# Altium project GWNv3.PrjPCB
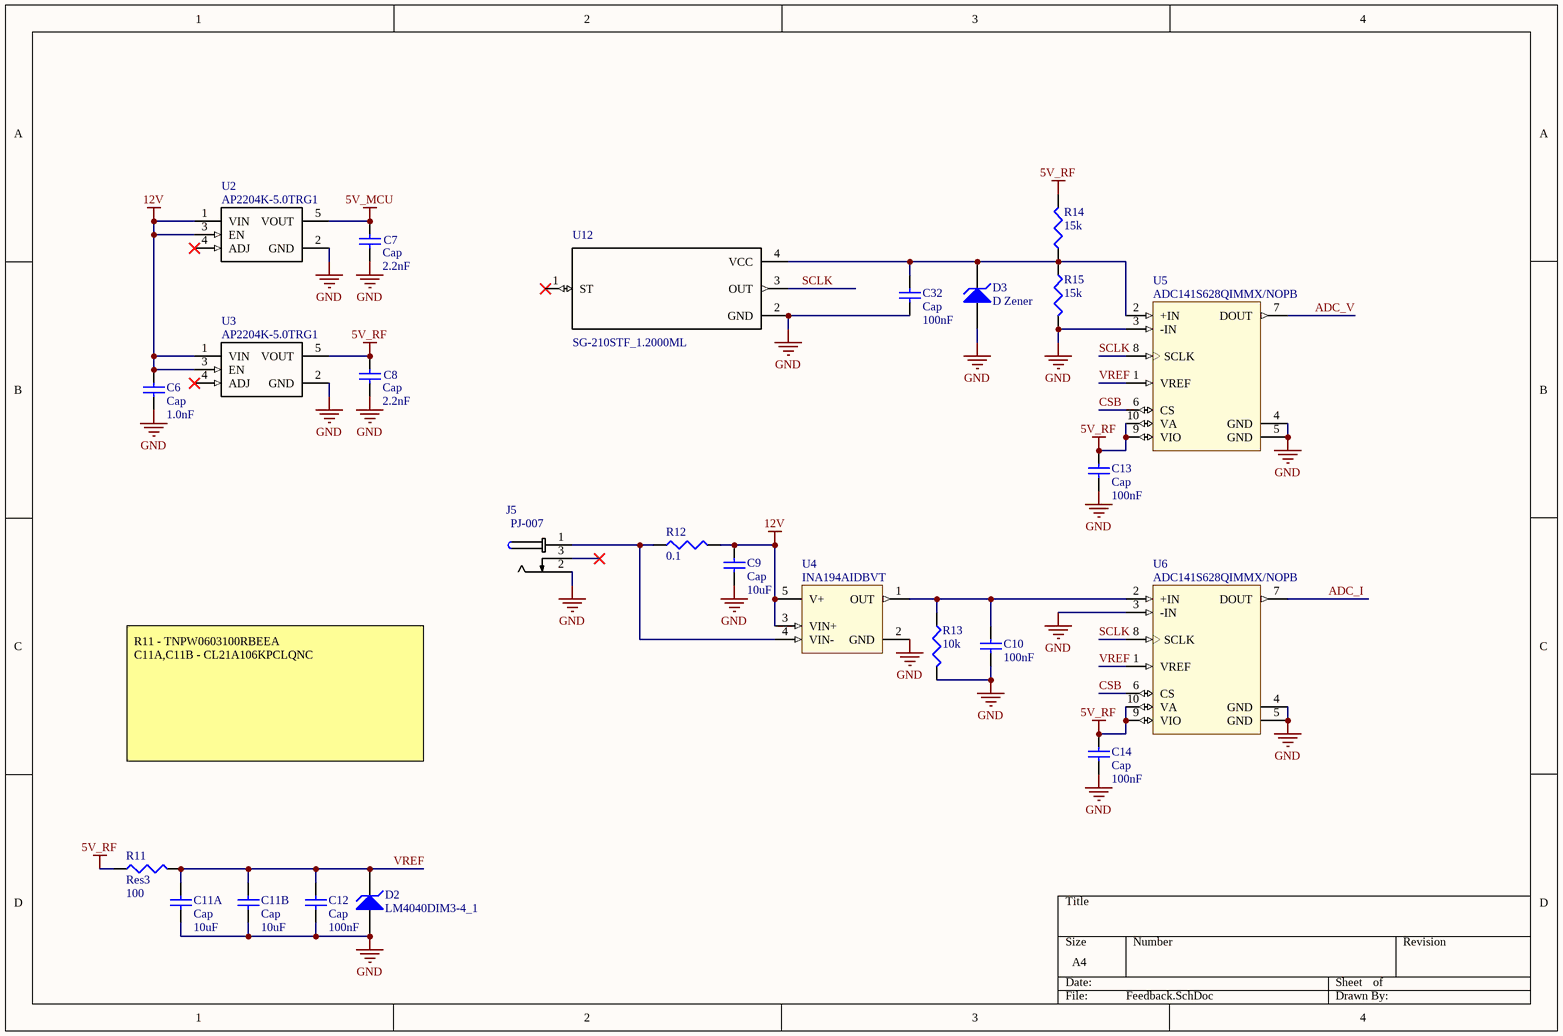
[diagram p0: Feedback.SchDoc]
3 sheets, 65 parts. Net scope: global (net labels, ports and power ports of the same name join across sheets).
Board files: GWNv3.PcbDoc, GWNv3_Station.PcbDoc
Sheets:
  Feedback.SchDoc
  RF.SchDoc
  BridgeRF.SchDoc

## Sheet Feedback.SchDoc
size A4

### Parts
C6  Cap  value 1.0nF  [1608[0603]]
C7  Cap  value 2.2nF  [1608[0603]]
C8  Cap  value 2.2nF  [1608[0603]]
C9  Cap  value 10uF  [C0805]
C10  100nF  [1608[0603]]
C11A  Cap  value 10uF  [C0805]
C11B  Cap  value 10uF  [C0805]
C12  Cap  value 100nF  [1608[0603]]
C13  Cap  value 100nF  [1608[0603]]
C14  Cap  value 100nF  [1608[0603]]
C32  Cap  value 100nF  [1608[0603]]
D2  LM4040DIM3-4_1  [SOT95P237X112-3N]
D3  D Zener  [SODFL250X110-2N]
J5  PJ-007  [PJ-007]
R11  Res3  value 100  [J1-0603]
R12  0.1  [TO-252-3]
R13  10k  [J1-0603]
R14  15k  [J1-0603]
R15  15k  [J1-0603]
U2  AP2204K-5.0TRG1  [SOT95P280X145-5N]
U3  AP2204K-5.0TRG1  [SOT95P280X145-5N]
U4  INA194AIDBVT  [SOT95P280X145-5N]
U5  ADC141S628QIMMX/NOPB  [SOP50P490X110-11N]
U6  ADC141S628QIMMX/NOPB  [SOP50P490X110-11N]
U12  SG-210STF_1.2000ML  [OSCCC200X160X50]

### Nets
5V_MCU: C7.2 U2.5(VOUT)
5V_RF: C8.2 C13.1 C14.1 R11.2 R14.1 U3.5(VOUT) U5.9(VIO) U5.10(VA) U6.9(VIO) U6.10(VA)
12V: C6.1 C9.1 R12.1 U2.1(VIN) U2.3(EN) U3.1(VIN) U3.3(EN) U4.3(VIN+) U4.5(V+)
GND: C6.2 C7.1 C8.1 C9.2 C10.1 C11A.2 C11B.2 C12.2 C13.2 C14.2 C32.2 D2.1(A) D3.1(A) J5.2(S) R13.2 R15.1 U2.2(GND) U3.2(GND) U4.2(GND) U5.3(-IN) U5.4(GND) U5.5(GND) U6.3(-IN) U6.4(GND) U6.5(GND) U12.2(GND)
ADC_I: U6.7(DOUT)
ADC_V: U5.7(DOUT)
CSB: U5.6(CS) U6.6(CS)
SCLK: U5.8(SCLK) U6.8(SCLK) U12.3(OUT)
VREF: C11A.1 C11B.1 C12.1 D2.2(K) R11.1 U5.1(VREF) U6.1(VREF)
NetC10_2: C10.2 R13.1 U4.1(OUT) U6.2(+IN)
NetC32_1: C32.1 D3.2(K) R14.2 R15.2 U5.2(+IN) U12.4(VCC)
NetJ5_1: J5.1(T) R12.2 U4.4(VIN-)

Not connected (* = marked no-connect by the designer): J5 3(SS)*; U2 4(ADJ)*; U3 4(ADJ)*; U12 1(ST)*

### Notes on the sheet
- R11 - TNPW0603100RBEEA
  C11A,C11B - CL21A106KPCLQNC

### Library data of the parts
C6-C10 C11A C11B C12-C14 C32 = Cap Semi: Capacitor (Semiconductor SIM Model); Published: 8-Jun-2000; LatestRevisionDate: 29-May-2009; LatestRevisionNote: IPC-7351 Footprint Added.; PackageReference: C1206; Publisher: Altium Limited; PackageDescription: Chip Capacitor
  C10: Value: 100nF
D2 = LM4040DIM3-4_1: IC VREF SHUNT 4.096V SOT23; MF: Texas Instruments; MP: LM404DIM4-4.1; Availability: Good; Package: SOT23 Texas Instruments; Price: 0.41 USD; Value: *; Supplier 1: Digi-Key; Supplier Part Number 1: LM4040DIM3-4.1/NOPBCT-ND
D3 = D Zener: Zener Diode; Published: 8-Jun-2000; LatestRevisionDate: 17-Jul-2002; LatestRevisionNote: Re-released for DXP Platform.; PackageReference: DIODE-0.7; Publisher: Altium Limited; PackageDescription: Diode, Thru-Hole; 2 Leads; 0.7 in Pin Spacing
J5 = PJ-007: 1.3 mm Center Pin, 1.0 A, Right Angle, Through Hole, Dc Power Jack Connector; MF: CUI; SnapEDA_Link: https://www.snapeda.com/parts/PJ-007/CUI/view-part/?ref=snap; Availability: Good; Package: None; Price: 0.36 USD; MP: PJ-007; Value: *
R11-R15 = Res3: Resistor; Published: 8-Jun-2000; LatestRevisionDate: 29-May-2009; LatestRevisionNote: IPC-7351 Footprint Added.; PackageReference: J1-0603; Publisher: Altium Limited; PackageDescription: Chip Resistor
  R12: Value: 0.1
  R13: Value: 10k
  R14 R15: Value: 15k
U2 U3 = AP2204K-5.0TRG1: IC REG LINEAR 5V 150MA SOT23-5; MF: Diodes Inc.; Availability: Good; MP: AP2204K-5.0TRG1; Price: 0.20 USD; Package: SOT-23-5 Diodes Inc.; Value: *
U4 = INA194AIDBVT: IC CURRENT MONITOR 3% SOT23-5; MF: Texas Instruments; Package: SOT-23 Texas Instruments; MP: INA194AIDBVT; Price: 1.55 USD; Availability: Good; Value: *
U5 U6 = ADC141S628QIMMX/NOPB: IC CONVERTER A/D 14-BIT 10-MSOP; MF: Texas Instruments; Availability: Good; Price: 4.07 USD; MP: ADC141S628QIMMX/NOPB; Package: MSOP-10 Texas Instruments; Value: *
U12 = SG-210STF_1.2000ML: Spxo 1.6-3.6v 50ppm -40/+85c; MP: SG-210STF 1.2000ML; MF: EPSON; Availability: Bad; SnapEDA_Link: https://www.snapeda.com/symbols-footprints/SG-210STF%201.2000ML/EPSON/view-part/?ref=snap; Package: SMD-4 Epson; Price: 1.41 USD; Value: *

## Sheet RF.SchDoc
size A4
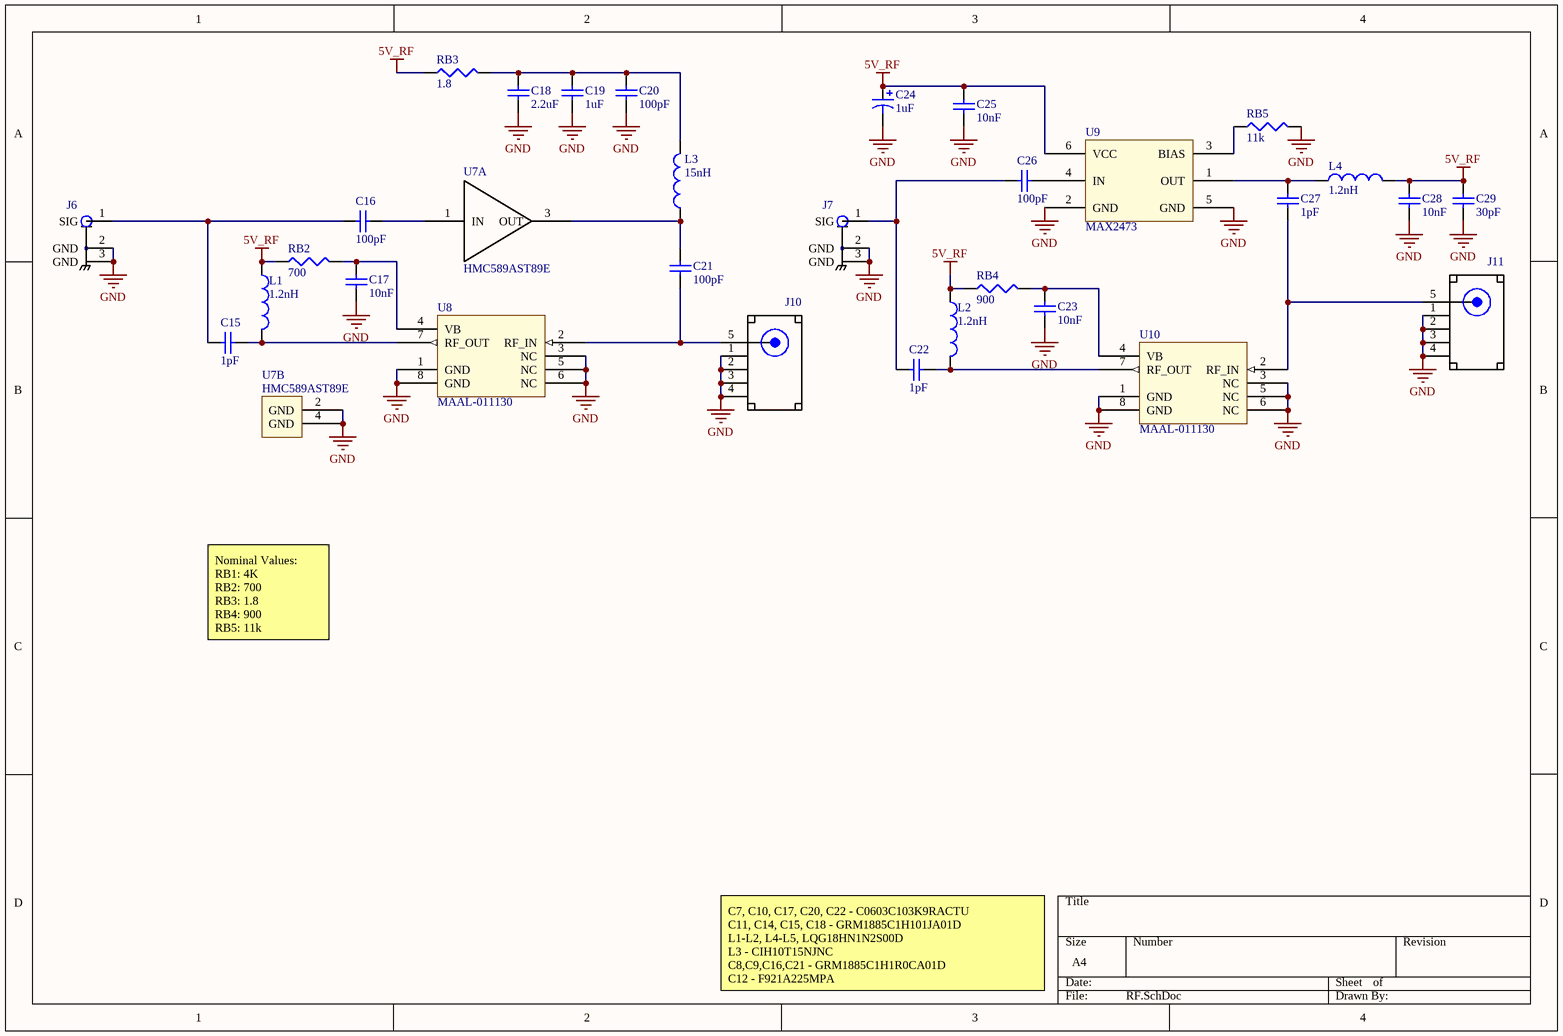
[diagram p1: RF.SchDoc]

### Parts
C15  1pF  [CAPC1608X90X35LL10T15]
C16  100pF  [CAPC0603(1608)100_N]
C17  10nF  [CAPC0603(1608)100_L]
C18  2.2uF  [C1206]
C19  1uF  [CAPC0603(1608)100_N]
C20  100pF  [CAPC0603(1608)100_N]
C21  100pF  [CAPC0603(1608)100_N]
C22  1pF  [CAPC1608X90X35LL10T15]
C23  10nF  [CAPC0603(1608)100_L]
C24  1uF  [CAPAE430X550N]
C25  10nF  [CAPC0603(1608)100_L]
C26  100pF  [CAPC0603(1608)100_N]
C27  1pF  [CAPC1608X90X35LL10T15]
C28  10nF  [CAPC0603(1608)100_L]
C29  30pF  [CAPC1608X90X35LL15T15]
J6  1909763-1  [TE_1909763-1]  (value not drawn)
J7  1909763-1  [TE_1909763-1]  (value not drawn)
J10  5-1814400-1  [CONN_5-1814400-1]  (value not drawn)
J11  5-1814400-1  [CONN_5-1814400-1]  (value not drawn)
L1  1.2nH  [INDC1608L]
L2  1.2nH  [INDC1608L]
L3  15nH  [INDC1608L]
L4  1.2nH  [INDC1608L]
RB2  700  [J1-0603]
RB3  1.8  [J1-0603]
RB4  900  [C1206]
RB5  11k  [J1-0603]
U7  HMC589AST89E  [SOT150P410X160-3N]  (parts A,B of 2)
U8  MAAL-011130  [PQFN50P200X200X100_HS-9N]
U9  MAX2473  [SOT95P280X145-6N]
U10  MAAL-011130  [PQFN50P200X200X100_HS-9N]

### Nets
5V_RF: C24.1 C25.2 C28.2 C29.2 L1.2 L2.2 L4.1 RB2.2 RB3.2 RB4.2 U9.6(VCC)
GND: C17.1 C18.1 C19.2 C20.2 C23.1 C24.2 C25.1 C28.1 C29.1 J6.2(GND) J6.3(GND) J7.2(GND) J7.3(GND) J10.1(GND) J10.2(GND) J10.3(GND) J10.4(GND) J11.1(GND) J11.2(GND) J11.3(GND) J11.4(GND) RB5.1 U7.2(GND) U7.4(GND) U8.1(GND) U8.3(NC) U8.5(NC) U8.6(NC) U8.8(GND) U9.2(GND) U9.5(GND) U10.1(GND) U10.3(NC) U10.5(NC) U10.6(NC) U10.8(GND)
NetC15_1: C15.1 C16.1 J6.1(SIG)
NetC15_2: C15.2 L1.1 U8.7(RF_OUT)
NetC16_2: C16.2 U7.1(IN)
NetC17_2: C17.2 RB2.1 U8.4(VB)
NetC18_2: C18.2 C19.1 C20.1 L3.1 RB3.1
NetC21_1: C21.1 L3.2 U7.3(OUT)
NetC21_2: C21.2 J10.5(SIGNAL) U8.2(RF_IN)
NetC22_1: C22.1 C26.1 J7.1(SIG)
NetC22_2: C22.2 L2.1 U10.7(RF_OUT)
NetC23_2: C23.2 RB4.1 U10.4(VB)
NetC26_2: C26.2 U9.4(IN)
NetC27_1: C27.1 J11.5(SIGNAL) U10.2(RF_IN)
NetC27_2: C27.2 L4.2 U9.1(OUT)
NetRB5_2: RB5.2 U9.3(BIAS)

### Notes on the sheet
- Nominal Values:
  RB1: 4K
  RB2: 700
  RB3: 1.8
  RB4: 900
  RB5: 11k
- C7, C10, C17, C20, C22 - C0603C103K9RACTU
  C11, C14, C15, C18 - GRM1885C1H101JA01D
  L1-L2, L4-L5, LQG18HN1N2S00D
  L3 - CIH10T15NJNC
  C8,C9,C16,C21 - GRM1885C1H1R0CA01D
  C12 - F921A225MPA

### Library data of the parts
C15 C22 C27 = CMP-2006-02464-1: Manufacturer: Murata; Part Number: GRM1885C1H1R0CA01D; Value: 1pF
  C27: Value2: *
C16 C19-C21 C26 = CMP-1035-01269-1: CAP 100pF 50V ±5% 0603 (1608 Metric) Thickness 1mm SMD; Case-EIA: 0603; Case-Metric: 1608; Tolerance: Â±5%; Max Thickness: 1 mm; Rated Voltage: 50 V; Technology: SMT
  C16 C20 C21 C26: Value: 100pF
  C19: Value: 1uF
C17 C23 C25 C28 = CMP-1035-02302-1: CAP 10nF 6.3V ±10% 0603 (1608 Metric) Thickness 1mm SMD; Case-EIA: 0603; Case-Metric: 1608; Tolerance: Â±10%; Value: 10nF; Max Thickness: 1 mm; Rated Voltage: 6.3 V; Technology: SMT
C18 = Cap Semi: Capacitor (Semiconductor SIM Model); Manufacturer: AVX; Part Number: F921A225MPA; Value: 2.2uF
C24 = Cap Pol3: Polarized Capacitor (Surface Mount); Manufacturer: Panasonic; Part Number: EEE-FC1H1R0R; Value: 1uF
C29 = CMP-2006-04292-1: Manufacturer: AVX Interconnect / Elco; Part Number: 06035A300JAT2A; Value: 30pF
J6 J7 = 1909763-1: CONN UMCC JACK STR 50OHM SMD; Number_of_Positions: 1; MF: TE Connectivity; Availability: Good; MP: 1909763-1; Price: 0.28 USD; Package: None; Value: *
J10 J11 = 5-1814400-1: SMA R/A PCB Skt GZD; Number_of_Positions: 1; MF: TE Connectivity; Digi-Key_Purchase_URL: https://www.digikey.com/product-detail/en/te-connectivity-amp-connectors/5-1814400-1/A97593-ND/1755981?WT.z_cid=ref_snapeda&utm_source=snapeda&utm_medium=aggregator&utm_campaign=buynow; Digi-Key_Part_Number: A97593-ND; EU_RoHS_Compliance: Compliant; Package: None; MP: 5-1814400-1; Link: http://www.te.com/usa-en/product-5-1814400-1.html; SnapEDA_Link: https://www.snapeda.com/symbols-footprints/5-1814400-1/TE%20Connectivity%20AMP%20Connectors/view-part/?ref=snap; Value: *
L1 L2 L4 = Inductor: Part Number: LQG15WH1N2S02D; Manufacturer: Murata; Value: 1.2nH
L3 = Inductor: Part Number: CIH10T15NJNC; Manufacturer: Samsung; Value: 15nH
RB2-RB5 = Res3: Resistor; Published: 8-Jun-2000; LatestRevisionDate: 29-May-2009; LatestRevisionNote: IPC-7351 Footprint Added.; PackageReference: J1-0603; Publisher: Altium Limited; PackageDescription: Chip Resistor
  RB2: Value: 700
  RB3: Value: 1.8
  RB4: Value: 900
  RB5: Value: 11k

## Sheet BridgeRF.SchDoc
size A4
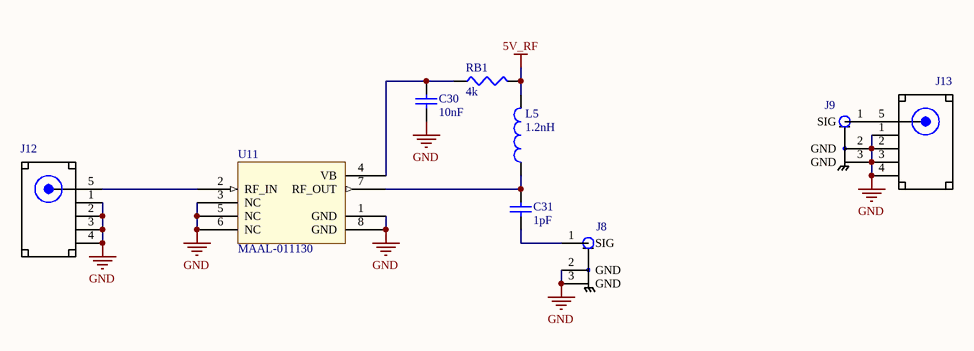
[diagram p2: BridgeRF.SchDoc]

### Parts
C30  10nF  [CAPC0603(1608)100_L]
C31  1pF  [CAPC1608X90X35LL10T15]
J8  1909763-1  [TE_1909763-1]  (value not drawn)
J9  1909763-1  [TE_1909763-1]  (value not drawn)
J12  5-1814400-1  [CONN_5-1814400-1]  (value not drawn)
J13  5-1814400-1  [CONN_5-1814400-1]  (value not drawn)
L5  1.2nH  [INDC1608L]
RB1  4k  [J1-0603]
U11  MAAL-011130  [PQFN50P200X200X100_HS-9N]

### Nets
5V_RF: L5.2 RB1.1
GND: C30.1 J8.2(GND) J8.3(GND) J9.2(GND) J9.3(GND) J12.1(GND) J12.2(GND) J12.3(GND) J12.4(GND) J13.1(GND) J13.2(GND) J13.3(GND) J13.4(GND) U11.1(GND) U11.3(NC) U11.5(NC) U11.6(NC) U11.8(GND)
NetC30_2: C30.2 RB1.2 U11.4(VB)
NetC31_1: C31.1 J8.1(SIG)
NetC31_2: C31.2 L5.1 U11.7(RF_OUT)
NetJ9_1: J9.1(SIG) J13.5(SIGNAL)
NetJ12_5: J12.5(SIGNAL) U11.2(RF_IN)

### Library data of the parts
C30 = CMP-1035-02302-1: as C17 on sheet RF; Value: 10nF; Max Thickness: 1 mm; Rated Voltage: 6.3 V; Technology: SMT
C31 = CMP-2006-02464-1: as C15 on sheet RF; Value: 1pF
J8 J9 = 1909763-1: as J6 on sheet RF; Availability: Good; MP: 1909763-1; Price: 0.28 USD; Package: None; Value: *
J12 J13 = 5-1814400-1: as J10 on sheet RF; Digi-Key_Purchase_URL: https://www.digikey.com/product-detail/en/te-connectivity-amp-connectors/5-1814400-1/A97593-ND/1755981?WT.z_cid=ref_snapeda&utm_source=snapeda&utm_medium=aggregator&utm_campaign=buynow; Digi-Key_Part_Number: A97593-ND; EU_RoHS_Compliance: Compliant; Package: None; MP: 5-1814400-1; Link: http://www.te.com/usa-en/product-5-1814400-1.html; SnapEDA_Link: https://www.snapeda.com/symbols-footprints/5-1814400-1/TE%20Connectivity%20AMP%20Connectors/view-part/?ref=snap; Value: *
L5 = Inductor: as L1 on sheet RF; Value: 1.2nH
RB1 = Res3: Resistor; Published: 8-Jun-2000; LatestRevisionDate: 29-May-2009; LatestRevisionNote: IPC-7351 Footprint Added.; PackageReference: J1-0603; Publisher: Altium Limited; PackageDescription: Chip Resistor; Value: 4k

## Nets that join several sheets
5V_RF: Feedback (10 pins), RF (11 pins), BridgeRF (L5.2 RB1.1)
GND: Feedback (26 pins), RF (36 pins), BridgeRF (18 pins)